# Altium schematic sheet RP2040.SchDoc
size A; SheetNumber: 7; SheetTotal: 10
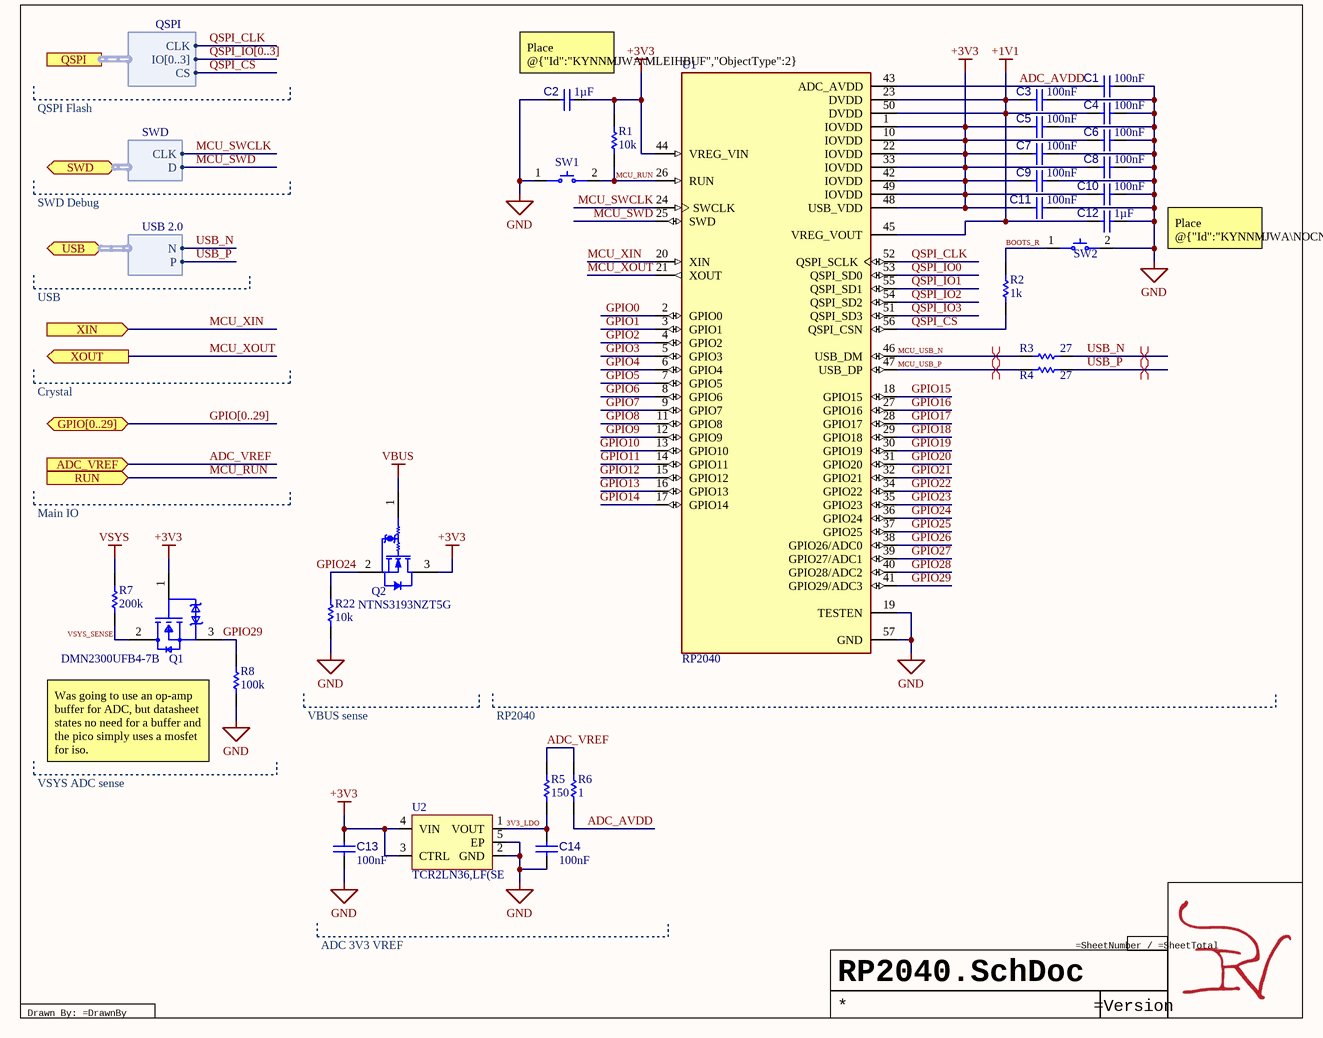
[diagram p0: RP2040.SchDoc]

## Parts
C1  value 100nF  [CAP 0201_0603]  (hidden comment: CL03A104KQ3NNNC)
C2  value 1µF  [CAP 0201_0603]  (hidden comment: GRM033R60J105MEA2D)
C3  value 100nF  [CAP 0201_0603]  (hidden comment: CL03A104KQ3NNNC)
C4  value 100nF  [CAP 0201_0603]  (hidden comment: CL03A104KQ3NNNC)
C5  value 100nF  [CAP 0201_0603]  (hidden comment: CL03A104KQ3NNNC)
C6  value 100nF  [CAP 0201_0603]  (hidden comment: CL03A104KQ3NNNC)
C7  value 100nF  [CAP 0201_0603]  (hidden comment: CL03A104KQ3NNNC)
C8  value 100nF  [CAP 0201_0603]  (hidden comment: CL03A104KQ3NNNC)
C9  value 100nF  [CAP 0201_0603]  (hidden comment: CL03A104KQ3NNNC)
C10  value 100nF  [CAP 0201_0603]  (hidden comment: CL03A104KQ3NNNC)
C11  value 100nF  [CAP 0201_0603]  (hidden comment: CL03A104KQ3NNNC)
C12  value 1µF  [CAP 0201_0603]  (hidden comment: GRM033R60J105MEA2D)
C13  value 100nF  [CAP 0201_0603]  (hidden comment: CL03A104KQ3NNNC)
C14  value 100nF  [CAP 0201_0603]  (hidden comment: CL03A104KQ3NNNC)
Q1  DMN2300UFB4-7B  [FP-X2-DFN1006-3-MFG]
Q2  NTNS3193NZT5G  [ONSC-XLLGA-3-713AB_V]
R1  value 10k  [RES 0201_0603]  (hidden comment: 10k-0201-0.05/1)
R2  value 1k  [RES 0201_0603]
R3  value 27  [RES 0201_0603]  (hidden comment: 27-0201-0.05/1)
R4  value 27  [RES 0201_0603]  (hidden comment: 27-0201-0.05/1)
R5  value 150  [RES 0201_0603]  (hidden comment: 150-0201-0.05/1)
R6  value 1  [RES 0201_0603]  (hidden comment: 1-0201-0.05/1)
R7  value 200k  [RES 0201_0603]  (hidden comment: 200k-0201-0.05/1)
R8  value 100k  [RES 0201_0603]  (hidden comment: 100k-0201-0.05/1)
R22  value 10k  [RES 0201_0603]  (hidden comment: 10k-0201-0.05/1)
SW1  EVP-BB2A9B000  [FP-EVP-BB2A9B000-MFG]  (value not drawn)
SW2  LS38G2F-T  [LS38G2F-T-Footprint-1]  (value not drawn)
U1  RP2040  [QFN40P700X700X90-57N]
U2  TCR2LN36,LF(SE  [SDFN4_TOS]

## Ports
ADC_VREF (in, see 2040Macro-PCB[2B], Connectors[1A]), GPIO[0..29] (bidir, see 2040Macro-PCB[2B], Connectors[1A]), QSPI (harness QSPI, see 2040Macro-PCB[3B], SPIFlash[1A]), RUN (in, see 2040Macro-PCB[2B], Connectors[1A]), SWD (bidir, harness SWD, see 2040Macro-PCB[2B], Connectors[3C]), USB (bidir, harness USB 2.0, see 2040Macro-PCB[2B], Connectors[1A], USBC-DEV-2.0[3B]), XIN (in, see 2040Macro-PCB[3B], Crystal[3B]), XOUT (out, see 2040Macro-PCB[3B], Crystal[3B])

## Harnesses
USB 2.0: N, P
SWD: CLK, D
QSPI: CLK, IO[0..3], CS

## Nets
+1V1: C3.1 C4.1 C12.1 U1.23(DVDD) U1.45(VREG_VOUT) U1.50(DVDD)
+3V3: C2.2 C5.1 C6.1 C7.1 C8.1 C9.1 C10.1 C11.1 C13.2 Q1.1(G) Q2.3(D) R1.2 U1.1(IOVDD) U1.10(IOVDD) U1.22(IOVDD) U1.33(IOVDD) U1.42(IOVDD) U1.44(VREG_VIN) U1.48(USB_VDD) U1.49(IOVDD) U2.3(CTRL) U2.4(VIN)
GND: C1.2 C2.1 C3.2 C4.2 C5.2 C6.2 C7.2 C8.2 C9.2 C10.2 C11.2 C12.2 C13.1 C14.1 R8.1 R22.1 SW1.1 SW2.2 U1.19(TESTEN) U1.57(GND) U2.2(GND) U2.5(EP)
VBUS: Q2.1(G)
VSYS: R7.2
3V3_LDO: C14.2 R5.1 U2.1(VOUT)
ADC_AVDD: C1.1 R6.1 U1.43(ADC_AVDD)
ADC_VREF: R5.2 R6.2 ; port ADC_VREF
BOOTS_R: R2.1 SW2.1
GPIO0: U1.2(GPIO0)
GPIO1: U1.3(GPIO1)
GPIO2: U1.4(GPIO2)
GPIO3: U1.5(GPIO3)
GPIO4: U1.6(GPIO4)
GPIO5: U1.7(GPIO5)
GPIO6: U1.8(GPIO6)
GPIO7: U1.9(GPIO7)
GPIO8: U1.11(GPIO8)
GPIO9: U1.12(GPIO9)
GPIO10: U1.13(GPIO10)
GPIO11: U1.14(GPIO11)
GPIO12: U1.15(GPIO12)
GPIO13: U1.16(GPIO13)
GPIO14: U1.17(GPIO14)
GPIO15: U1.18(GPIO15)
GPIO16: U1.27(GPIO16)
GPIO17: U1.28(GPIO17)
GPIO18: U1.29(GPIO18)
GPIO19: U1.30(GPIO19)
GPIO20: U1.31(GPIO20)
GPIO21: U1.32(GPIO21)
GPIO22: U1.34(GPIO22)
GPIO23: U1.35(GPIO23)
GPIO24: Q2.2(S) R22.2 U1.36(GPIO24)
GPIO25: U1.37(GPIO25)
GPIO26: U1.38(GPIO26/ADC0)
GPIO27: U1.39(GPIO27/ADC1)
GPIO28: U1.40(GPIO28/ADC2)
GPIO29: Q1.3(S) R8.2 U1.41(GPIO29/ADC3)
MCU_RUN: R1.1 SW1.2 U1.26(RUN) ; port RUN
MCU_SWCLK: U1.24(SWCLK) ; port SWD.CLK
MCU_SWD: U1.25(SWD) ; port SWD.D
MCU_USB_N: R3.1 U1.46(USB_DM)
MCU_USB_P: R4.1 U1.47(USB_DP)
MCU_XIN: U1.20(XIN) ; port XIN
MCU_XOUT: U1.21(XOUT) ; port XOUT
QSPI_CLK: U1.52(QSPI_SCLK) ; port QSPI.CLK
QSPI_CS: R2.2 U1.56(QSPI_CSN) ; port QSPI.CS
QSPI_IO0: U1.53(QSPI_SD0)
QSPI_IO1: U1.55(QSPI_SD1)
QSPI_IO2: U1.54(QSPI_SD2)
QSPI_IO3: U1.51(QSPI_SD3)
USB_N: R3.2 ; port USB.N
USB_P: R4.2 ; port USB.P
VSYS_SENSE: Q1.2(D) R7.1

## Buses and harness runs
bus GPIO[0..29] = port GPIO[0..29]
bus QSPI_IO[0..3]

## Layout directives
differential pair: MCU_USB_N, MCU_USB_P, USB_N, USB_P

## Notes on the sheet
- (near C2) Place @{"Id":"KYNNMJWA\MLEIHBUF","ObjectType":2} close to pin 44
- QSPI Flash
- SWD Debug
- USB
- Place @{"Id":"KYNNMJWA\NOCNSBLD","ObjectType":2} close to pin 45
- Crystal
- Main IO
- Was going to use an op-amp buffer for ADC, but datasheet states no need for a buffer and the pico simply uses a mosfet for iso.
- VBUS sense
- RP2040
- VSYS ADC sense
- ADC 3V3 VREF
- Drawn By: =DrawnBy

## Library data of the parts
C1 C3-C11 C13 C14 = CMP-001-00029-1: Ceramic Capacitor, Multilayer, Ceramic, 6.3V, 10% +Tol, 10% -Tol, X5R, 15% TC, 0.1uF, Surface Mount, 0201; Multilayer: Yes; Temperature Characteristics Code: X5R; Capacitor Type: Ceramic; Min Operating Temperature: -55°C; Reach SVHC Compliant: Yes; Termination: Wraparound; Mounting Technology: Surface Mount; Terminal Finish: Nickel; Pins: 2; JESD-609 Code: e3; Rated DC Voltage (URdc): 6.3V; Case/Package: 0201; Packaging: Tape and Reel; Tolerance  (fill in as +-): 10%; Height: 0.3mm; Length: 0.6mm; Package Shape: Rectangular; Max Operating Temperature: 85°C; Package Style: SMTMeter; Tolerance (fill in as +-): 10%; RoHS Compliant: Yes; Dielectric Material: Ceramic; Width: 0.3mm
C2 C12 = CMP-001-00030-2: Ceramic Capacitor, Multilayer, Ceramic, 6.3V, 20% +Tol, 20% -Tol, X5R, 15% TC, 1uF, Surface Mount, 0201; Multilayer: Yes; Reach SVHC Compliant: Yes; Min Operating Temperature: -55°C; Mounting Technology: Surface Mount; Temperature Characteristics Code: X5R; Tolerance (fill in as +-): 20%; Capacitor Type: Ceramic; Pins: 2; Tolerance  (fill in as +-): 20%; RoHS Compliant: Yes; JESD-609 Code: e3; Package Shape: Rectangular; Dielectric Material: Ceramic; Max Operating Temperature: 85°C; Packaging: Tape and Reel; Terminal Finish: Nickel; Rated DC Voltage (URdc): 6.3V; Case/Package: 0201; Termination: Wraparound
Q1 = CMP-013-00001-1: Small Signal Field-Effect Transistor, 1.3A I(D), 20V, 1-Element, N-Channel, Silicon, Metal-oxide Semiconductor FET; Transistor Application: SWITCHING; Qualification Status: Not Qualified; Package Body Material: Plastic; Case Connection: DRAIN; Drain-source On Resistance-Max: 175mR; Time @ Peak Reflow Temperature-Max (s): 40s; Number of Elements: 1; Operating Mode: ENHANCEMENT MODE; Power Dissipation-Max (Abs): 470mW; Package Shape: Rectangular; Package Style: CHIP CARRIERMeter; Transistor Element Material: SILICON; Drain Current-Max (Abs) (ID): 1.3A; Max Operating Temperature: 150°C; FET Technology: METAL-OXIDE SEMICONDUCTOR; Terminal Form: No Lead; Polarity/Channel Type: N-CHANNEL; DS Breakdown Voltage-Min: 20V; RoHS Compliant: Yes; JESD-609 Code: e4; Drain Current-Max (ID): 1.3A; Moisture Sensitivity Level: 1; Reach SVHC Compliant: Yes; Surface Mount: Yes; Terminal Position: BOTTOM; Terminal Finish: Nickel; Peak Reflow Temperature (Cel): 260°C; Pins: 3
Q2 = CMP-013-00002-1: Small Signal Field-Effect Transistor, 0.224A I(D), 1-Element, N-Channel, Metal-oxide Semiconductor FET; Power Dissipation-Max (Abs): 139mW; Drain Current-Max (Abs) (ID): 224mA; RoHS Compliant: Yes; Polarity/Channel Type: N-CHANNEL; Terminal Finish: Nickel; Max Operating Temperature: 150°C; Reach SVHC Compliant: Yes; Surface Mount: Yes; Moisture Sensitivity Level: 1; JESD-609 Code: e4; FET Technology: METAL-OXIDE SEMICONDUCTOR
R1 R22 = CMP-009-00054-1: Fixed Resistor, Metal Glaze/thick Film, 0.05W, 10000ohm, 25V, 1% +/-Tol, 200ppm/Cel, Surface Mount, 0201; Rated Temperature: 70°C; Power: 50mW; Package Height: 0.23mm; Temperature Coefficient: 200ppm/°C; Package Width: 0.3mm; Reference Standard: AEC-Q200; Package Length: 0.6mm; RoHS Compliant: Yes; JESD-609 Code: e3; Resistor Type: FIXED RESISTOR; Termination: Wraparound; Pins: 2; Technology: METAL GLAZE/THICK FILM; Terminal Finish: Nickel; Mounting Technology: Surface Mount; Package Shape: Rectangular; Reach SVHC Compliant: Yes; Package Style: SMTMeter; Case/Package: 0201; Working Voltage: 25V; Packaging: Tape and Reel; Construction: Rectangular; Max Operating Temperature: 125°C; Min Operating Temperature: -55°C; Tolerance: 1%
R2 = CMP-009-00051-1: Fixed Resistor, Metal Glaze/thick Film, 0.05W, 1000ohm, 25V, 1% +/-Tol, 200ppm/Cel, Surface Mount, 0201; Power: 50mW; Package Height: 0.23mm; Package Width: 0.3mm; Reference Standard: AEC-Q200; Package Length: 0.6mm; Rated Temperature: 70°C; Temperature Coefficient: 200ppm/°C; Package Shape: Rectangular; Package Style: SMTMeter; Resistor Type: FIXED RESISTOR; Technology: METAL GLAZE/THICK FILM; Case/Package: 0201; RoHS Compliant: Yes; Termination: Wraparound; Terminal Finish: Nickel; Max Operating Temperature: 125°C; Reach SVHC Compliant: Yes; Packaging: Tape and Reel; Tolerance: 1%; Min Operating Temperature: -55°C; Pins: 2; Working Voltage: 25V; Mounting Technology: Surface Mount; JESD-609 Code: e3; Construction: Rectangular
R3 R4 = CMP-009-00052-2: Fixed Resistor, Metal Glaze/thick Film, 0.05W, 27ohm, 25V, 1% +/-Tol, 200ppm/Cel, Surface Mount, 0201; Temperature Coefficient: 200ppm/°C; Package Width: 0.3mm; Package Length: 0.6mm; Reference Standard: AEC-Q200; Power: 50mW; Package Height: 0.23mm; Rated Temperature: 70°C; Resistor Type: FIXED RESISTOR; Construction: Rectangular; Tolerance: 1%; Pins: 2; Min Operating Temperature: -55°C; Mounting Technology: Surface Mount; Working Voltage: 25V; Case/Package: 0201; Packaging: Tape and Reel; Technology: METAL GLAZE/THICK FILM; Terminal Finish: Nickel; RoHS Compliant: Yes; Package Style: SMTMeter; Termination: Wraparound; Max Operating Temperature: 125°C; Package Shape: Rectangular; JESD-609 Code: e3; Reach SVHC Compliant: Yes
R5 = CMP-009-00059-1: Fixed Resistor, Metal Glaze/thick Film, 0.05W, 150ohm, 25V, 1% +/-Tol, 200ppm/Cel, Surface Mount, 0201; Package Width: 0.3mm; Package Height: 0.23mm; Power: 50mW; Reference Standard: AEC-Q200; Package Length: 0.6mm; Temperature Coefficient: 200ppm/°C; Rated Temperature: 70°C; Reach SVHC Compliant: Yes; Package Shape: Rectangular; Package Style: SMTMeter; Max Operating Temperature: 125°C; RoHS Compliant: Yes; Termination: Wraparound; Min Operating Temperature: -55°C; Tolerance: 1%; Working Voltage: 25V; Technology: METAL GLAZE/THICK FILM; Packaging: Tape and Reel; Mounting Technology: Surface Mount; Pins: 2; Construction: Rectangular; Terminal Finish: Nickel; JESD-609 Code: e3; Resistor Type: FIXED RESISTOR; Case/Package: 0201
R6 = CMP-009-00060-1: Fixed Resistor, Metal Glaze/thick Film, 0.05W, 1ohm, 25V, 1% +/-Tol, -100,350ppm/Cel, Surface Mount, 0201; Package Length: 0.6mm; Reference Standard: AEC-Q200; Rated Temperature: 70°C; Power: 50mW; Temperature Coefficient: 350ppm/°C; Additional Feature: LASER TRIMMABLE; Package Width: 0.3mm; Package Height: 0.23mm; Construction: Chip; Working Voltage: 25V; Terminal Finish: Nickel; Resistor Type: FIXED RESISTOR; Reach SVHC Compliant: Yes; Min Operating Temperature: -55°C; Packaging: Tape and Reel; Tolerance: 1%; Termination: Wraparound; Pins: 2; Case/Package: 0201; Mounting Technology: Surface Mount; Technology: METAL GLAZE/THICK FILM; Package Style: SMTMeter; RoHS Compliant: Yes; Max Operating Temperature: 125°C; JESD-609 Code: e3; Package Shape: Rectangular
R7 = CMP-009-00058-1: Fixed Resistor, Metal Glaze/thick Film, 0.05W, 200000ohm, 25V, 1% +/-Tol, 200ppm/Cel, Surface Mount, 0201; Package Length: 0.6mm; Reference Standard: AEC-Q200; Package Width: 0.3mm; Power: 50mW; Temperature Coefficient: 200ppm/°C; Rated Temperature: 70°C; Package Height: 0.23mm; Termination: Wraparound; Tolerance: 1%; Reach SVHC Compliant: Yes; Mounting Technology: Surface Mount; Pins: 2; Working Voltage: 25V; Construction: Rectangular; Resistor Type: FIXED RESISTOR; RoHS Compliant: Yes; Package Shape: Rectangular; Technology: METAL GLAZE/THICK FILM; Case/Package: 0201; Terminal Finish: Nickel; JESD-609 Code: e3; Min Operating Temperature: -55°C; Packaging: Tape and Reel; Max Operating Temperature: 125°C; Package Style: SMTMeter
R8 = CMP-009-00057-1: Fixed Resistor, Metal Glaze/thick Film, 0.05W, 100000ohm, 25V, 1% +/-Tol, 200ppm/Cel, Surface Mount, 0201; Package Length: 0.6mm; Temperature Coefficient: 200ppm/°C; Package Width: 0.3mm; Rated Temperature: 70°C; Reference Standard: AEC-Q200; Package Height: 0.23mm; Power: 50mW; Resistor Type: FIXED RESISTOR; Package Shape: Rectangular; Mounting Technology: Surface Mount; Max Operating Temperature: 125°C; RoHS Compliant: Yes; Termination: Wraparound; Package Style: SMTMeter; Terminal Finish: Nickel; JESD-609 Code: e3; Reach SVHC Compliant: Yes; Construction: Rectangular; Min Operating Temperature: -55°C; Pins: 2; Packaging: Tape and Reel; Working Voltage: 25V; Tolerance: 1%; Technology: METAL GLAZE/THICK FILM; Case/Package: 0201
SW1 = CMP-011-00001-4: Switch Tactile N.O. SPST Round Button Gull Wing 0.02A 15VDC 1.6N SMD T/R
SW2 = CMP-011-00002-1: Top-press Tactile Switch
U1 = CMP-781-000000-2: Mcu, 32 Bit, 133MHZ, QFN-56;; MF: {'manufacturer': u'Raspberry Pi'}; Availability: Unavailable; MP: RP2040; Source: RP2040.SchLib; Value: *; Design Item ID: RP2040; Price: None; Package: None
U2 = CMP-817-000000-2: LDO Voltage Regulators LDO Reg Vout=3.6V I=200mA; Mfr_Name: Toshiba Electronic Devices & Storage Corp.; Number_devices_in_Package: 1; Design Item ID: TCR2LN36; Source: TCR2LN36.SchLib; Type: Type; RefDes: Refdes; Source_Package: TCR2LN36